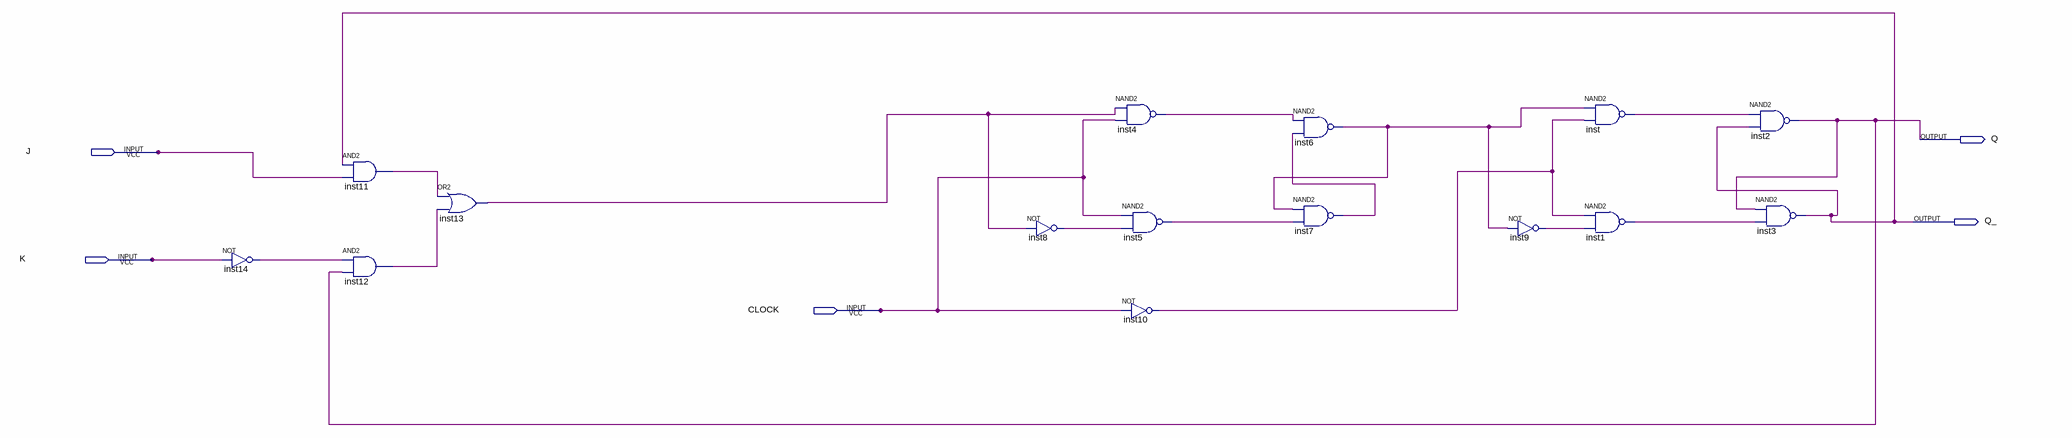
[diagram p0: schematic sheet]
// Quartus schematic askisi2.bdf as structural Verilog: 15 symbols, 5 pins
module askisi2 (
  input  J,
  input  K,
  input  CLOCK,
  output Q,
  output Q_
);

  wire inst1_out, inst4_out, inst5_out, inst6_out, inst7_out, inst8_out, inst9_out, inst10_out, inst11_out,
       inst12_out, inst13_out, inst14_out, inst_out;

  not inst14 (inst14_out, K);
  and inst11 (inst11_out, Q_, J);
  and inst12 (inst12_out, inst14_out, Q);
  or inst13 (inst13_out, inst11_out, inst12_out);
  not inst8 (inst8_out, inst13_out);
  nand inst4 (inst4_out, inst13_out, CLOCK);
  nand inst5 (inst5_out, CLOCK, inst8_out);
  not inst10 (inst10_out, CLOCK);
  nand inst6 (inst6_out, inst4_out, inst7_out);
  nand inst7 (inst7_out, inst6_out, inst5_out);
  not inst9 (inst9_out, inst6_out);
  nand inst (inst_out, inst6_out, inst10_out);
  nand inst1 (inst1_out, inst10_out, inst9_out);
  nand inst2 (Q, inst_out, Q_);
  nand inst3 (Q_, Q, inst1_out);
endmodule
